# EAGLE schematic schematic (EAGLE 9.3.0)
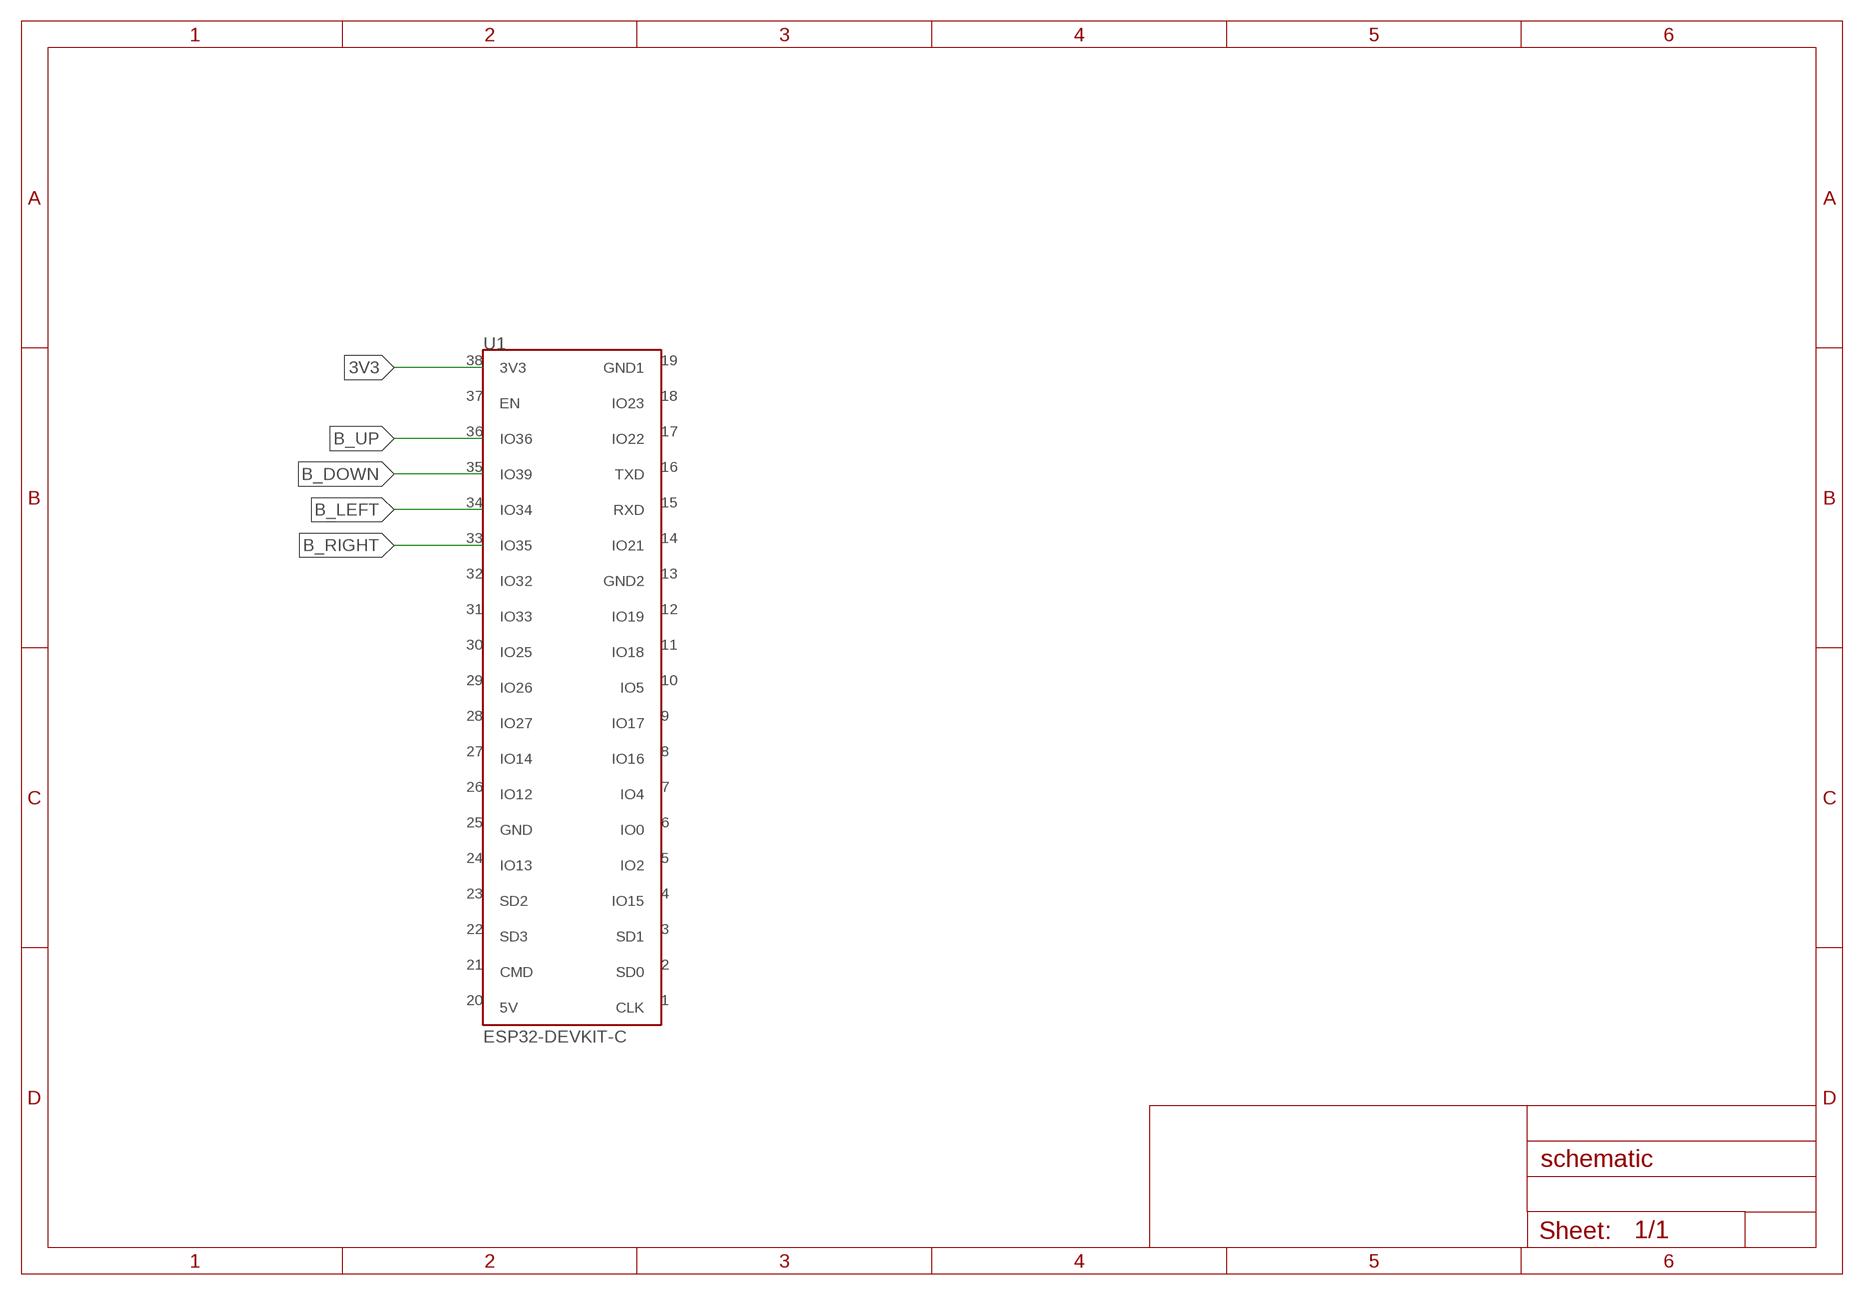
[diagram p0: schematic, sheet 1]

## Parts
U1  ESP32-DEVKIT-C  [ESP32]

## Nets
3V3: U1.38(3V3)
B_DOWN: U1.35(IO39)
B_LEFT: U1.34(IO34)
B_RIGHT: U1.33(IO35)
B_UP: U1.36(IO36)
Unconnected: U1.1(CLK) U1.2(SD0) U1.3(SD1) U1.4(IO15) U1.5(IO2) U1.6(IO0) U1.7(IO4) U1.8(IO16) U1.9(IO17) U1.10(IO5) U1.11(IO18) U1.12(IO19) U1.14(IO21) U1.15(RXD) U1.16(TXD) U1.17(IO22) U1.18(IO23) U1.21(CMD) U1.22(SD3) U1.23(SD2) U1.24(IO13) U1.26(IO12) U1.27(IO14) U1.28(IO27) U1.29(IO26) U1.30(IO25) U1.31(IO33) U1.32(IO32) U1.37(EN)

## Power pins joined to a net without a drawn wire
5V: U1.20(5V)
GND: U1.25(GND)
GND1: U1.19(GND1)
GND2: U1.13(GND2)

## Library data of the parts
U1 = angelo:ESP32-DEVKIT-C